# EAGLE design relay interface v4 (EAGLE 7.1.0)
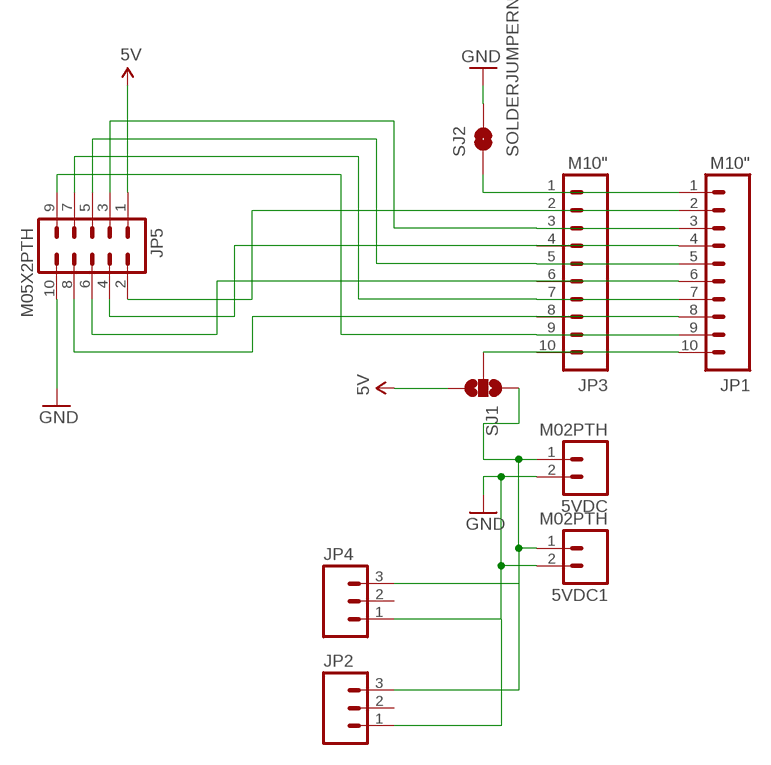
[diagram p0: schematic, sheet 1]

## Parts
5VDC  M02PTH  [1X02]
5VDC1  M02PTH  [1X02]
JP1  M10"  [1X10]
JP2  M03PTH  [1X03]
JP3  M10"  [1X10]
JP4  M03PTH  [1X03]
JP5  M05X2PTH  [AVR_ICSP]
SJ1  SOLDERJUMPER_2WAYS  [SJ_3]
SJ2  SOLDERJUMPERNO  [SJ_2S-NO]

## Nets
5V: JP5.1 SJ1.3
GND: 5VDC1.2 5VDC.2 JP2.1 JP4.1 JP5.10 SJ2.2
N$1: JP1.2 JP3.2 JP5.2
N$2: JP1.3 JP3.3 JP5.3
N$3: JP1.4 JP3.4 JP5.4
N$4: JP1.5 JP3.5 JP5.5
N$5: JP1.10 JP3.10 SJ1.2
N$7: JP1.6 JP3.6 JP5.6
N$8: JP1.7 JP3.7 JP5.7
N$9: JP1.8 JP3.8 JP5.8
N$10: JP1.9 JP3.9 JP5.9
N$15: 5VDC1.1 5VDC.1 JP2.3 JP4.3 SJ1.1
N$16: JP1.1 JP3.1 SJ2.1
Unconnected: JP2.2 JP4.2

## Library data of the parts
5VDC 5VDC1 = SparkFun-Connectors:M02: Standard 2-pin 0.1" header. Use with - straight break away headers ( PRT-00116) - right angle break away headers (PRT-00553) - swiss pins (PRT-00743) - machine pins (PRT-00117) - female headers (PRT-00115) Molex polarized connector foot print use with: PRT-08233 with associated crimp pins and housings. 2.54_SCREWTERM for use with PRT-10571. 3.5mm Screw Terminal footprints for PRT-08084 5mm Screw Terminal footprints for use with PRT-08432
JP1 JP3 = SparkFun-Connectors:M10: Header 10 Standard 10-pin 0.1" header. Use with straight break away headers (SKU : PRT-00116), right angle break away headers (PRT-00553), swiss pins (PRT-00743), machine pins (PRT-00117), and female headers (PRT-00115).
JP2 JP4 = SparkFun-Connectors:M03: Header 3 Standard 3-pin 0.1" header. Use with straight break away headers (SKU : PRT-00116), right angle break away headers (PRT-00553), swiss pins (PRT-00743), machine pins (PRT-00117), and female headers (PRT-00115). Molex polarized connector foot print use with SKU : PRT-08232 with associated crimp pins and housings.
JP5 = SparkFun-Connectors:M05X2: Header 5x2 Standard 10-pin dual row 0.1" header. Commonly used with AVR-ISP. Use with Spark Fun Electronics SKU: PRT-00778
SJ1 = SparkFun-Retired:SOLDERJUMPER_2WAY: Solder Jumper 2 way solder jumper
SJ2 = SparkFun-Retired:SOLDERJUMPER: Solder Jumper Standard SMD solder jumper. Used to automate production. Two varients : Normally Open and Normally Closed are the same, but have different paste layers. NC will have a large amount of paste and should jumper during reflow.

## Board
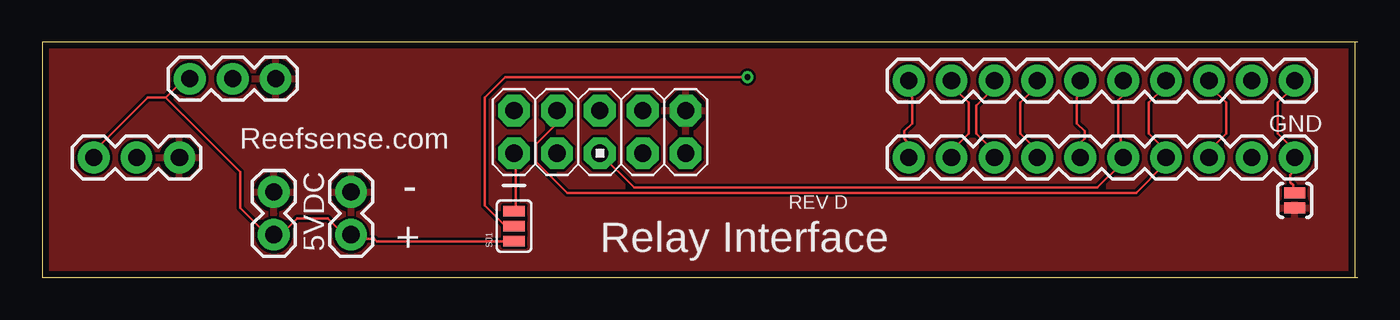
[diagram p1: board, top side]
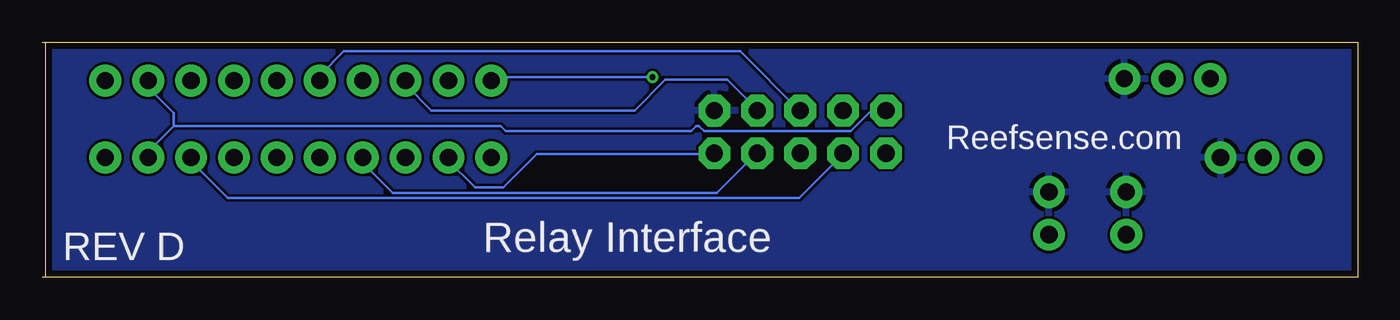
[diagram p2: board, bottom side, seen from below]

Size 77.9 x 13.96 mm. Coordinates in mm from the lower left corner, seen from the top.
Outline: 77.72,0 0,0 0,13.96 77.72,13.96
Outline: 77.72,0 77.9,0
Outline: 77.9,13.96 77.72,13.96
Outline: 77.72,13.96 77.72,0
Copper layers (1*16): Top 0.0356mm / dielectric 1.5011mm / Bottom 0.0356mm
Design rules "LaenPCBOrder": minimum track width 6mil, minimum drill 13mil, track to track 6mil, track to pad 6mil, pad to pad 6mil, via to via 6mil, smd to smd 6mil, copper to edge 15mil, drill to drill 6mil, minimum pad ring 7mil, minimum via ring 7mil, stop-mask expansion 3mil, vias tented up to drill 0mil, thermal gap 10mil

### Footprints (pad centres in the part's own frame; a part is rotated, then mirrored left to right if it is on the bottom)
1X02 = drill 1.016 pad 1.88: 1 0,0; 2 2.54,0
1X10 = drill 1.016 pad 1.88: 1 0,0; 2 2.54,0; 3 5.08,0; 4 7.62,0; 5 10.16,0; 6 12.7,0; 7 15.24,0; 8 17.78,0; 9 20.32,0; 10 22.86,0
1X03 = drill 1.016 pad 1.88: 1 0,0; 2 2.54,0; 3 5.08,0
AVR_ICSP = drill 1.016 pad 1.88 octagon: 1 -1.27,5.08; 2 1.27,5.08; 3 -1.27,2.54; 4 1.27,2.54; 5 -1.27,0; 6 1.27,0; 7 -1.27,-2.54; 8 1.27,-2.54; 9 -1.27,-5.08; 10 1.27,-5.08
SJ_3 = smd 0.635 x 1.27: 1 -0.889,0; 2 0,0; 3 0.889,0
SJ_2S-NO = smd 0.635 x 1.27: 1 -0.45,0; 2 0.45,0

### Placement (x,y rotation side)
5VDC  13.72,2.54 90 top
5VDC1  18.29,2.54 90 top
JP1  74.17,11.68 180 top
JP2  13.82,11.79 180 top
JP3  74.17,7.11 180 top
JP4  8.13,7.11 180 top
JP5  33.02,8.64 90 top
SJ1  27.94,3.05 90 top
SJ2  74.17,4.57 270 top

### Tracks (layer width: path | path; a pad name or v marks a point on that pad's centre or on a via)
5V
  Top 0.152: SJ1.3 28.04,3.96 28.04,7.32 JP5.1
GND
  pour Top: -14.22,23.37 80.26,21.34 80.26,-3.56 -13.72,-2.54
  pour Bottom: -13.72,-2.54 80.77,-4.06 80.26,22.35 -14.22,23.88
N$1
  Bottom 0.152: JP5.2 28.8,9.91 30.02,8.69 38.71,8.69 39.01,8.99 39.17,8.99 39.47,8.69 50.44,8.69 50.75,8.99 70.1,8.99 | 70.1,8.99 71.63,7.47 JP3.2 | JP1.2 71.63,11.28 70.1,9.75 70.1,8.99
N$2
  Top 0.152: JP1.3 69.19,11.58 69.19,11.28 70.1,10.36 70.1,8.53 69.19,7.62 69.19,7.16 JP3.3
  Bottom 0.152: JP5.3 30.48,7.32 33.07,4.72 66.9,4.72 69.19,7.01 JP3.3
N$3
  Top 0.152: JP5.4 30.48,9.14 29.26,7.92 29.26,6.86 31.09,5.03 64.77,5.03 66.45,6.71 66.45,7.01 JP3.4 66.45,7.16 66.45,7.62 65.53,8.53 65.53,10.36 66.45,11.28 66.45,11.58 JP1.4
N$4
  Top 0.152: JP5.5 35.05,5.33 62.48,5.33 64.01,6.86 JP3.5 64.01,7.16 63.86,7.32 63.86,8.23 63.7,8.38 63.7,10.52 64.01,10.82 JP1.5
N$5  (via drill 0.33)
  Top 0.152: SJ1.2 27.43,3.05 26.21,4.27 26.21,10.67 27.43,11.89 v41.76,11.89 | JP3.10 51.21,7.16 51.21,8.08 51.05,8.23 51.05,8.69 51.51,9.14 51.51,10.67 51.36,10.82 51.36,11.58 JP1.10
  Bottom 0.152: v41.76,11.89 50.29,11.89 50.44,11.73 51.21,11.73 JP1.10
N$7
  Top 0.152: JP3.6 61.57,7.16 61.57,8.08 61.72,8.23 61.72,8.69 61.27,9.14 61.27,10.67 61.42,10.82 61.42,11.58 JP1.6
  Bottom 0.152: JP5.6 33.07,9.91 36.58,13.41 60.05,13.41 61.42,12.04 61.42,11.73 JP1.6
N$8
  Top 0.152: JP1.7 58.83,11.58 58.83,11.28 57.91,10.36 57.91,8.53 58.83,7.62 58.83,7.16 JP3.7
  Bottom 0.152: JP5.7 35.66,7.32 37.95,5.03 57.15,5.03 58.83,6.71 58.83,7.01 JP3.7
N$9
  Top 0.152: JP3.8 56.39,7.47 55.32,8.53 55.32,10.21 56.39,11.28 JP1.8
  Bottom 0.152: JP1.8 56.39,11.43 54.86,9.91 42.82,9.91 41,11.73 37.34,11.73 36.12,10.52 36.12,10.36 35.66,9.91 JP5.8
N$10
  Top 0.152: JP1.9 53.95,11.58 53.95,11.28 54.86,10.36 54.86,8.53 53.95,7.62 53.95,7.16 JP3.9
  Bottom 0.152: JP5.9 38.1,7.32 48.62,7.32 50.6,5.33 52.27,5.33 53.95,7.01 JP3.9
N$15
  Top 0.152: JP4.3 3.05,7.47 6.25,10.67 7.32,10.67 | 7.32,10.67 8.38,11.73 8.69,11.73 JP2.3 | SJ1.1 27.89,2.13 19.81,2.13 19.66,2.29 18.44,2.29 18.29,2.44 5VDC1.1 18.29,2.59 17.83,2.59 16.92,3.5 15.09,3.5 14.17,2.59 13.72,2.59 | 7.32,10.67 11.73,6.25 11.73,4.12 13.26,2.59 13.72,2.59 | 13.72,2.59 5VDC.1
N$16
  Top 0.152: SJ2.1 74.07,5.03 74.07,5.49 73.91,5.64 73.91,6.1 74.07,6.25 74.07,7.01 JP3.1 74.07,7.16 74.07,7.62 73.15,8.53 73.15,10.36 74.07,11.28 74.07,11.58 JP1.1

### Text on the board
tNames: GND | Reefsense.com | - | REV D | + | Relay Interface
bNames: Reefsense.com | Relay Interface | REV D